# Altium schematic sheet Isolator.SchDoc
size A4
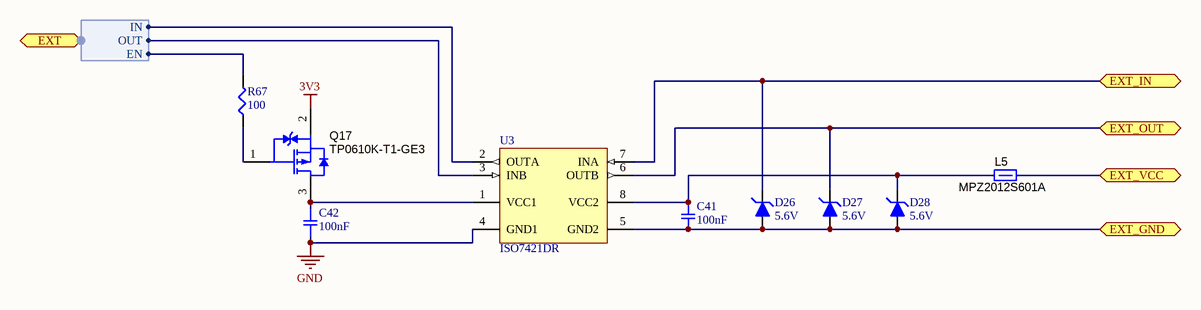
[diagram p0: Isolator.SchDoc]

## Parts
C41  100nF  [SMD-0603C]
C42  100nF  [SMD-0603C]
D26  5.6V  [SOD-323]
D27  5.6V  [SOD-323]
D28  5.6V  [SOD-323]
L5  MPZ2012S601A  [SMD-0805-RES]
Q17  TP0610K-T1-GE3  [SOT23-3]
R67  100  [SMD-0603-RES]
U3  ISO7421DR  [D0008A_N]

## Ports
EXT (harness EXT), EXT_GND, EXT_IN, EXT_OUT, EXT_VCC

## Harnesses
EXT: IN, OUT, EN

## Nets
3V3: Q17.2(S)
GND: C42.2 U3.4(GND1)
EXT_GND: C41.2 D26.2(A) D27.2(A) D28.2(A) U3.5(GND2) ; port EXT_GND
EXT_IN: D26.1(K) U3.7(INA) ; port EXT_IN
EXT_OUT: D27.1(K) U3.6(OUTB) ; port EXT_OUT
EXT_VCC: L5.1 ; port EXT_VCC
NetC41_1: C41.1 D28.1(K) L5.2 U3.8(VCC2)
NetC42_1: C42.1 Q17.3(D) U3.1(VCC1)
NetQ17_1: Q17.1(G) R67.1
NetR67_2: R67.2 ; port EXT.EN
NetU3_2: U3.2(OUTA) ; port EXT.IN
NetU3_3: U3.3(INB) ; port EXT.OUT

## Library data of the parts
C41 C42 = GCJ188R71C104KA01D: CAP CER 0.1UF 16V X7R 0603; Manufacturer: Murata Electronics North America; Factory Stock: 0; Unit Price (USD): 0.21; Minimum Quantity: 1; Value: 0.10µF; Tolerance: ±10%; Datasheets: http://www.murata.com/~/media/webrenewal/support/library/catalog/products/capacitor/mlcc/c03e.ashx; Image: //media.digikey.com/Renders/Murata%20Renders/0603%28LQG18%29.jpg; Digi-Key Part Number: 490-5796-1-ND; Part Number: GCJ188R71C104KA01D; Quantity Available: 22473; @ qty: 0; Packaging: Cut Tape (CT); Series: GCJ; Part Status: Active; Voltage: 16V; Temperature Coefficient: X7R; Operating Temperature: -55°C ~ 125°C; Features: Soft Termination; Ratings: AEC-Q200; Applications: Automotive, Boardflex Sensitive; Mounting Type: Surface Mount, MLCC; Package / Case: 0603 (1608 Metric); Size / Dimension: 0.063" L x 0.031" W (1.60mm x 0.80mm); Height - Seated (Max): -; Thickness (Max): 0.035" (0.90mm); Lead Spacing: -; Lead Style: -
D26-D28 = ZENER_5V6: Zener Diode 5.6V
L5 = BLM18SG221TN1D: Ferrite Bead; Manufacturer: MuRata; Imax_A: 2.5; DCR_ohm: 0.04; Value1: 0.04 ohm; Value2: 2.5A; ZTyp@100MHz_Ohm: 220; Value: 220 ohm; CompType: Ferrite Bead; SymbolVersion: 2009-06-02; PartNumber: BLM18SG221TN1D; MountType: SMT; PackageReference: 0603; Published: 2014-04-30; Publisher: Texas Instruments; LatestRevisionDate: 2015-05-26; ComponentLink1Description: Datasheet link; ComponentLink1URL: http://search.murata.co.jp/Ceramy/image/img/PDF/ENG/L0110S0100BLM18S.pdf; RoHS: Y; Supplier 1: Digi-Key; Supplier Part Number 1: 490-5225-1-ND; Supplier 2: Mouser; Supplier Part Number 2: 81-BLM18SG221TN1D; Supplier 3: Farnell; Supplier Part Number 3: 1515753
Q17 = TP0610K-T1-GE3: MOSFET, P-CH, -60 V, -0.185 A, SOT-23; Manufacturer: Vishay-Siliconix; Alternate Manufacturer: None; SymbolCreator: a0411947; U/M: EA; ChType: P; Value: -60V; Value1: 10 ohm; Rdson45_ohm: 10; Value2: 1.7 nC; QgTyp_nC: 1.7; Vgs_V: 20; SymbolVersion: 2013-05-16; PartNumber: TP0610K-T1-GE3; PackageReference: SOT-23; CompType: MOSFET; VdsMax_V: -60; IdsMax_A: -0.185; RoHS: Y; MountType: SMT; Published: 2008-06-19; Publisher: Texas Instruments; LatestRevisionDate: 2015-06-05; LatestRevisionNote: Added parts.; ComponentLink1Description: Datasheet link; ComponentLink1URL: http://www.vishay.com/docs/71411/tp0610k.pdf; Supplier 1: Digi-Key; Supplier Part Number 1: TP0610K-T1-GE3CT-ND; Supplier 2: Mouser; Supplier Part Number 2: 781-TP0610K-T1-GE3; Supplier 3: Farnell; Supplier Part Number 3: 1794816
R67 = ERJ-3EKF1000V: RES SMD 100 OHM 1% 1/10W 0603; Manufacturer: Panasonic Electronic Components; Factory Stock: 0; Unit Price (USD): 0.00379; @ qty: 1500; Minimum Quantity: 1; Power (Watts): 0.1W, 1/10W; Temperature Coefficient: ±100ppm/°C; Part Number: ERJ-3EKF1000V; Datasheets: http://industrial.panasonic.com/www-cgi/jvcr13pz.cgi?E+PZ+3+AOA0002+ERJ3EKF1000V+7+WW; Image: //media.digikey.com/Photos/Panasonic%20Photos/MFG_ERJ-P6W%20Series.jpg; Digi-Key Part Number: P100HCT-ND; Quantity Available: 1544120; Packaging: Cut Tape (CT); Series: ERJ; Part Status: Active; Value: 100; Tolerance: ±1%; Composition: Thick Film; Features: Automotive AEC-Q200; Operating Temperature: -55°C ~ 155°C; Package / Case: 0603 (1608 Metric); Supplier Device Package: 0603; Size / Dimension: 0.063" L x 0.031" W (1.60mm x 0.80mm); Height - Seated (Max): 0.022" (0.55mm); Number of Terminations: 2; Failure Rate: -
U3 = ISO7421DR: 1 Mbps Dual Channels, 1 / 1, Digital Isolator, 3.3 V / 5 V, -40 to +105 degC, 8-pin SOIC (D), Green (RoHS & no Sb/Br); Manufacturer: Texas Instruments; Datarate(Mbps): 1; Input Noise Filter: None; Insulation Rating(VRMS): 2500; Prop Delay(Max)(ns): 12; Rating: Catalog; Supply Voltage(s)(V): 3.3, 5; TTL/CMOS Input Threshold: TTL; DatasheetVersion: SLLS984E; PackageVersion: 4040047-3/M, 06/2011; PackageReference: D0008A; PackageDescription: 8-Pin Plastic Small Outline, Body 4.9 x 3.9 mm, Pitch 1.27 mm; Supplier 1: Digi-Key; Supplier Part Number 1: ISO7421DR-ND; Supplier 2: Newark; Supplier Part Number 2: 50R7698; Supplier 3: Mouser; Supplier Part Number 3: 595-ISO7421DR; SubFamily: Isolator; Thermal Shutdown: No; MountType: SMT; Code_JEDEC: MS-012; PartNumber: ISO7421DR; ComponentLink1Description: Manufacturer URL; ComponentLink1URL: http://www.ti.com/; ComponentLink2Description: Datasheet; ComponentLink2URL: http://www.ti.com/general/docs/lit/getliterature.tsp?genericPartNumber=ISO7421&fileType=pdf; ComponentLink3Description: Package Specification; ComponentLink3URL: http://www.ti.com/litv/pdf/msoi002j; ComponentLink4Description: SamplesURL; ComponentLink4URL: http://www.ti.com/product/iso7421#samples